# Altium project picphlipvfd.PrjPCB
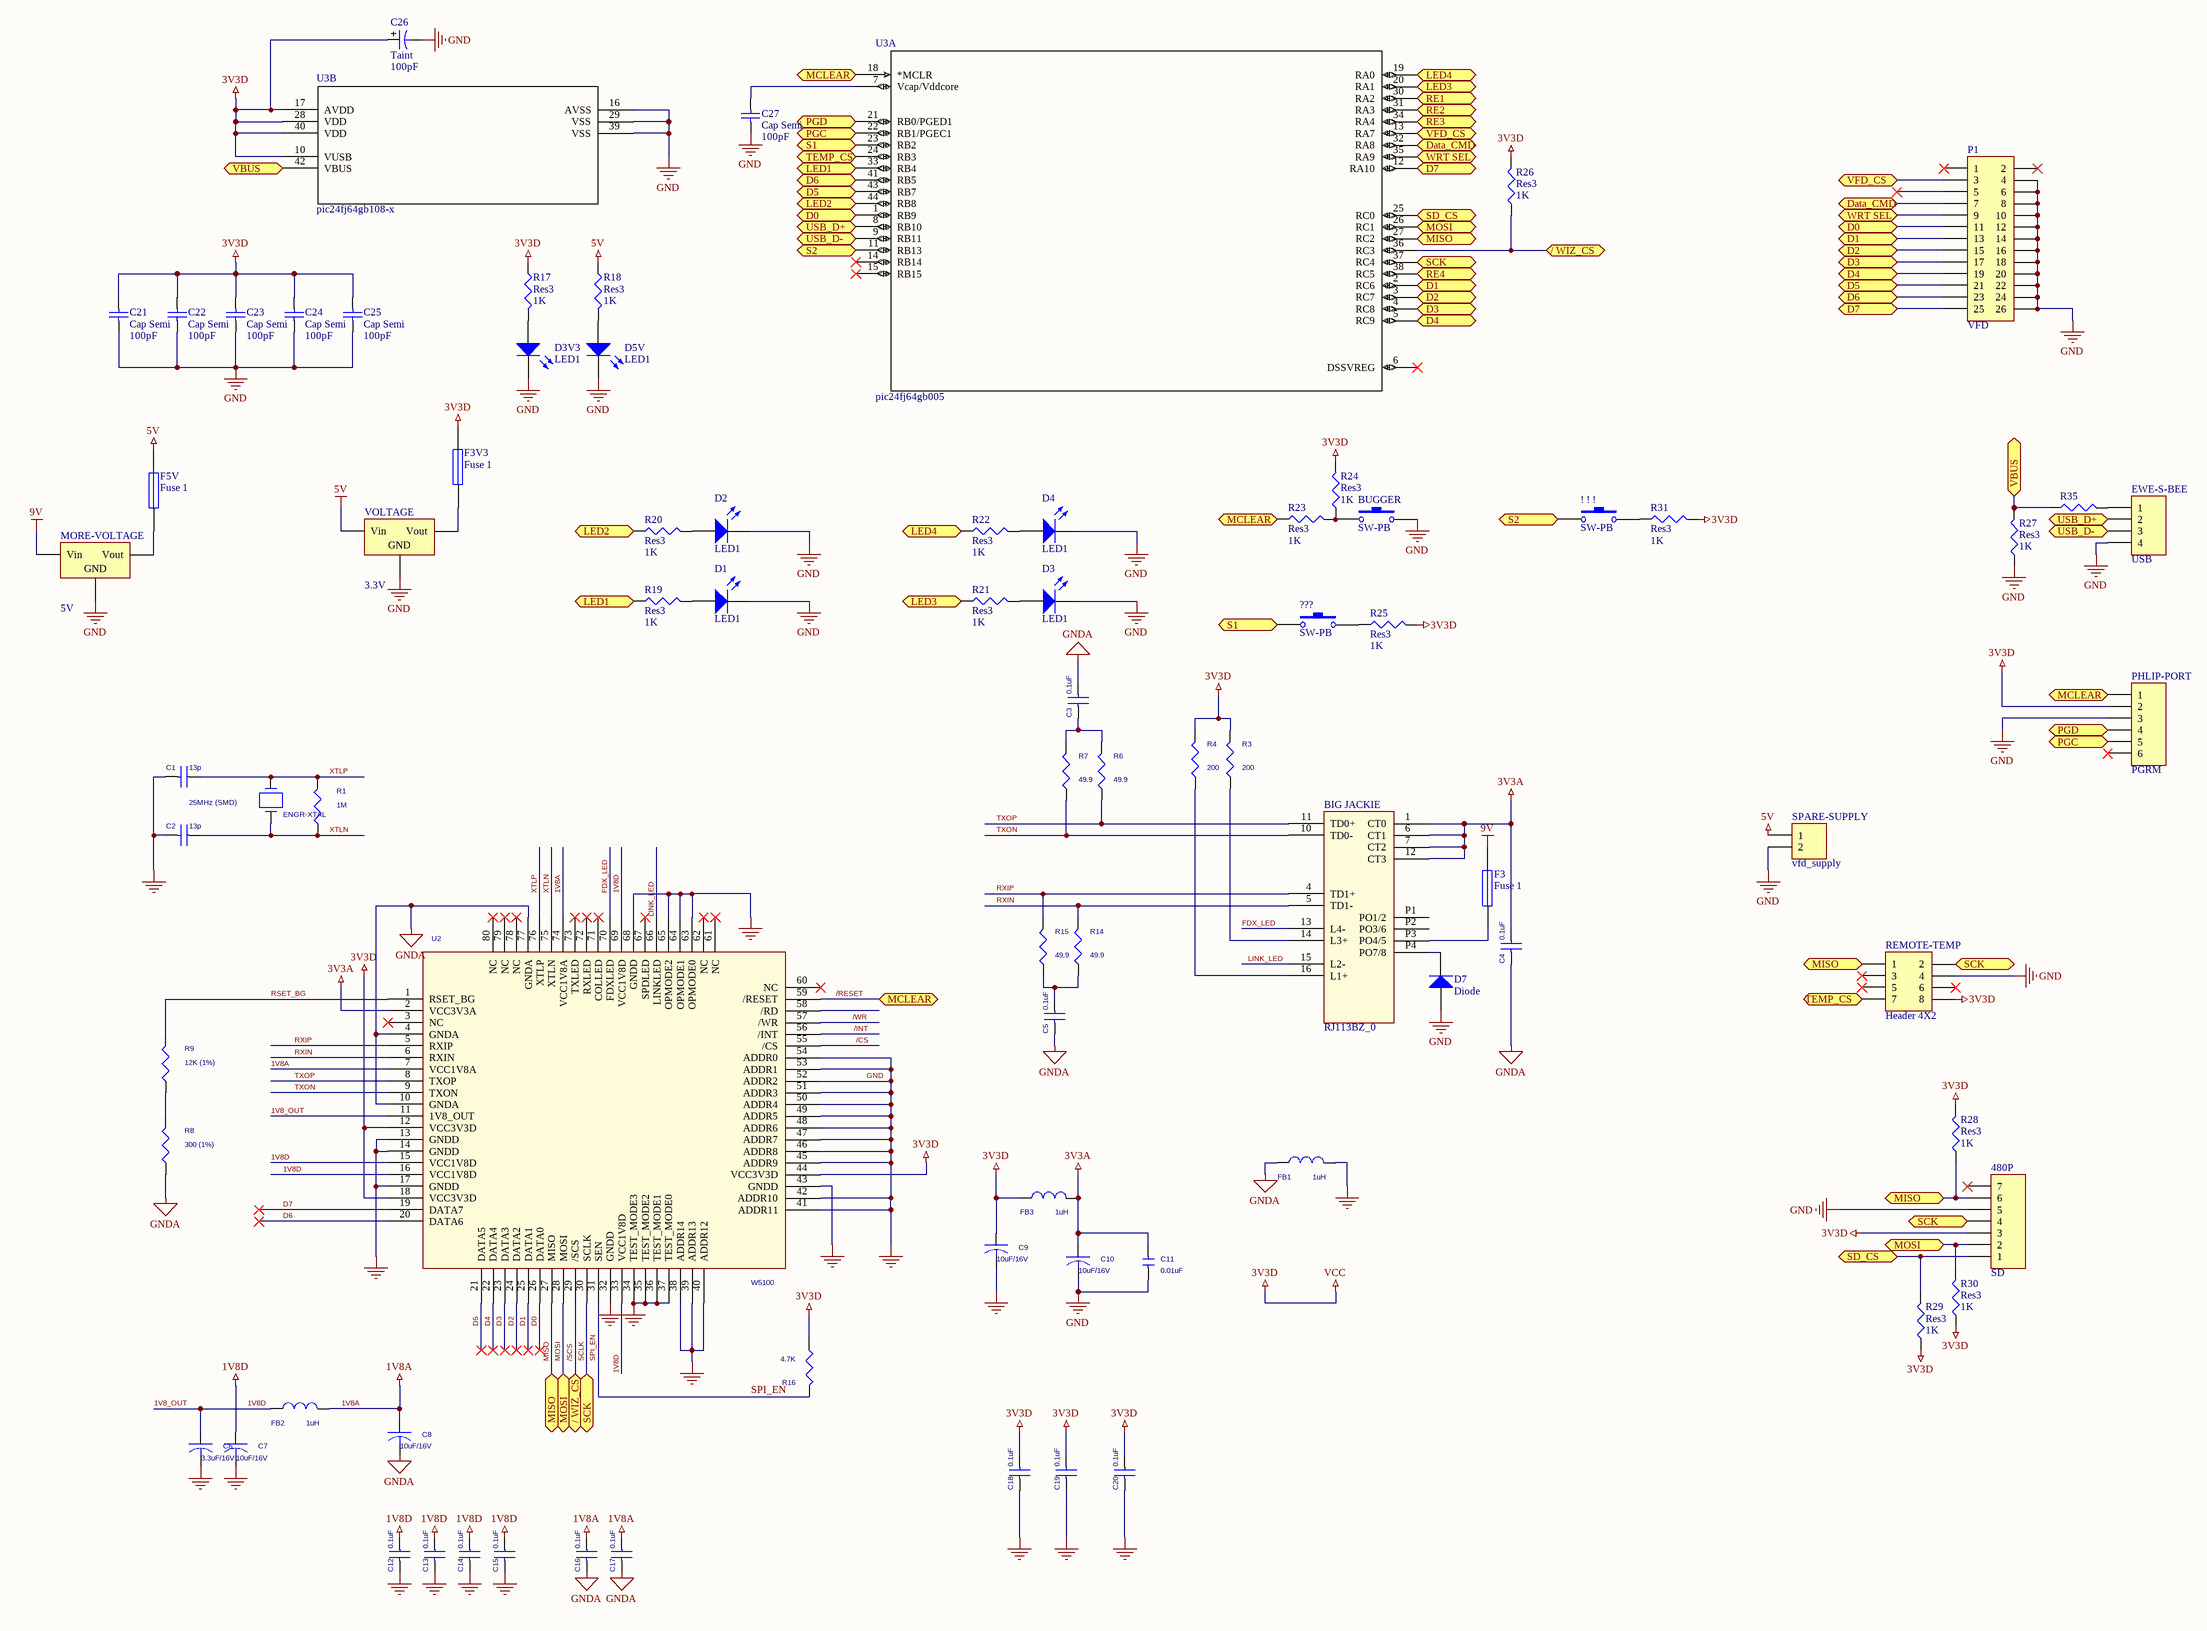
[diagram p0: picphlipvfd.SchDoc]
1 sheet, 81 parts. Net scope: flat (ports and power ports of the same name join across sheets).
Board file: picphlipvfd.PcbDoc

## Sheet picphlipvfd.SchDoc
size C; PageSetup: Record=PageOptions|CenterHorizontal=True|CenterVertical=True|PrintScale=2.17|XCorrection=1.00|YCorrection=1.00|PrintKind=1|BorderSize=5000000|LeftOffset=0|BottomOffset=0|Orientation=2|PaperLength=1000|PaperWidth=1000|Scale=100|PaperSource=7|PrintQuality=-4|MediaType=1|DitherType=10|PaperKind=A0|PrintScaleMode=1

### Parts
480P  SD  [MICRO-SD]
!_!_!  SW-PB  [Switch7914]
BIG_JACKIE  RJ113BZ_0  [POE]
BUGGER  SW-PB  [SWITCH-TACTILE-SPST-SMT-GULL-NO-KST241GLFS]
C1  13p  [CAP-0603]
C2  13p  [CAP-0603]
C3  0.1uF  [CAP-0603]
C4  0.1uF  [CAP-0603]
C5  0.1uF  [CAP-0603]
C6  3.3uF/16V  [CAP-0805]
C7  10uF/16V  [CAP-0805]
C8  10uF/16V  [CAP-0805]
C9  10uF/16V  [CAP-0805]
C10  10uF/16V  [CAP-0805]
C11  0.01uF  [CAP-0603]
C12  0.1uF  [CAP-0603]
C13  0.1uF  [CAP-0603]
C14  0.1uF  [CAP-0603]
C15  0.1uF  [CAP-0603]
C16  0.1uF  [CAP-0603]
C17  0.1uF  [CAP-0603]
C18  0.1uF  [CAP-0603]
C19  0.1uF  [CAP-0603]
C20  0.1uF  [CAP-0603]
C21  Cap Semi  value 100pF  [1608[0603]]
C22  Cap Semi  value 100pF  [1608[0603]]
C23  Cap Semi  value 100pF  [1608[0603]]
C24  Cap Semi  value 100pF  [1608[0603]]
C25  Cap Semi  value 100pF  [1608[0603]]
C26  Taint  value 100pF  [CAP-0805]
C27  Cap Semi  value 100pF  [1608[0603]]
D1  LED1  [LED-SMT-0603]
D2  LED1  [LED-SMT-0603]
D3  LED1  [LED-SMT-0603]
D3V3  LED1  [LED-SMT-0603]
D4  LED1  [LED-SMT-0603]
D5V  LED1  [LED-SMT-0603]
D7  Diode  [CAP-0805]
ENGR-XTAL  25MHz (SMD)  [XTAL-20MHZ-ATS200-SM]
EWE-S-BEE  USB  [CONN-USB-MICROB-SMT]
F3  Fuse 1  [INDUCTOR-0805]
F3V3  Fuse 1  [CAP-0805]
F5V  Fuse 1  [CAP-0805]
FB1  1uH  [INDUCTOR-0805]
FB2  1uH  [INDUCTOR-0805]
FB3  1uH  [INDUCTOR-0805]
MORE-VOLTAGE  5V  [TO-220]
P1  VFD  [HDR13F]
PHLIP-PORT  PGRM  [CONN-HEADER-HOR-SMT-1x6]
R1  1M  [RES-0603]
R3  200  [RES-0603]
R4  200  [RES-0603]
R6  49.9  [RES-0603]
R7  49.9  [RES-0603]
R8  300 (1%)  [CAP-0603]
R9  12K (1%)  [RES-0603]
R14  49.9  [RES-0603]
R15  49.9  [RES-0603]
R16  4.7K  [RES-0603]
R17  Res3  value 1K  [J1-0603]
R18  Res3  value 1K  [J1-0603]
R19  Res3  value 1K  [J1-0603]
R20  Res3  value 1K  [J1-0603]
R21  Res3  value 1K  [J1-0603]
R22  Res3  value 1K  [J1-0603]
R23  Res3  value 1K  [J1-0603]
R24  Res3  value 1K  [J1-0603]
R25  Res3  value 1K  [J1-0603]
R26  Res3  value 1K  [J1-0603]
R27  Res3  value 1K  [J1-0603]
R28  Res3  value 1K  [J1-0603]
R29  Res3  value 1K  [J1-0603]
R30  Res3  value 1K  [J1-0603]
R31  Res3  value 1K  [J1-0603]
R35  Res3  value 1K  [J1-0603]
REMOTE-TEMP  Header 4X2  [HDR2X4]
S1  SW-PB  [Switch7914]
SPARE-SUPPLY  vfd_supply  [PHO2pos2.54]
U2  W5100  [Quad80]
U3  pic24fj64gb005  [TQFP_44_M]  (parts A,B of 2)
VOLTAGE  3.3V  [TO-220]

### Ports
/ WIZ_CS, D0, D1, D2, D3, D4, D5, D6, D7, Data_CMD, LED1, LED2, LED3, LED4, MCLEAR, MISO, MOSI, PGC, PGD, RE1, RE2, RE3, RE4, S1, S2, SCK, SD_CS, TEMP_CS, USB_D+, USB_D-, VBUS, VFD_CS, WRT SEL

### Nets
1V8_OUT: C6.1 C7.1 C12.1 C13.1 C14.1 C15.1 FB2.1 U2.11(1V8_OUT) U2.15(VCC1V8D) U2.16(VCC1V8D) U2.33(VCC1V8D) U2.69(VCC1V8D)  [also labelled 1V8D]
1V8A: C8.1 C16.1 C17.1 FB2.2 U2.7(VCC1V8A) U2.74(VCC1V8A)
3V3A: BIG_JACKIE.1(CT0) BIG_JACKIE.6(CT1) BIG_JACKIE.7(CT2) BIG_JACKIE.12(CT3) C4.1 C10.1 C11.1 FB3.2 U2.2(VCC3V3A)
3V3D: 480P.3 C9.1 C18.1 C19.1 C20.1 C21.2 C22.2 C23.2 C24.2 C25.2 C26.1 F3V3.2 FB3.1 PHLIP-PORT.2 R3.2 R4.2 R16.1 R17.1 R24.2 R25.2 R26.2 R28.2 R29.1 R30.1 R31.2 REMOTE-TEMP.8 U2.12(VCC3V3D) U2.18(VCC3V3D) U2.44(VCC3V3D) U3.10(VUSB) U3.17(AVDD) U3.28(VDD) U3.40(VDD)  [also labelled VCC]
5V: F5V.2 R18.1 SPARE-SUPPLY.1 VOLTAGE.1(Vin)
9V: F3.2 MORE-VOLTAGE.1(Vin)
GND: 480P.5 BUGGER.2 C1.2 C2.2 C6.2 C7.2 C9.2 C10.2 C11.2 C12.2 C13.2 C14.2 C15.2 C18.2 C19.2 C20.2 C21.1 C22.1 C23.1 C24.1 C25.1 C26.2 C27.1 D1.2(K) D2.2(K) D3.2(K) D3V3.2(K) D4.2(K) D5V.2(K) D7.1(A) EWE-S-BEE.4 FB1.2 MORE-VOLTAGE.2(GND) P1.4 P1.6 P1.8 P1.10 P1.12 P1.14 P1.16 P1.18 P1.20 P1.22 P1.24 P1.26 PHLIP-PORT.3 R27.1 REMOTE-TEMP.4 SPARE-SUPPLY.2 U2.13(GNDD) U2.14(GNDD) U2.17(GNDD) U2.32(GNDD) U2.34(TEST_MODE3) U2.35(TEST_MODE2) U2.36(TEST_MODE1) U2.37(TEST_MODE0) U2.38(ADDR14) U2.39(ADDR13) U2.40(ADDR12) U2.41(ADDR11) U2.42(ADDR10) U2.43(GNDD) U2.45(ADDR9) U2.46(ADDR8) U2.47(ADDR7) U2.48(ADDR6) U2.49(ADDR5) U2.50(ADDR4) U2.51(ADDR3) U2.52(ADDR2) U2.53(ADDR1) U2.54(ADDR0) U2.63(OPMODE0) U2.64(OPMODE1) U2.65(OPMODE2) U2.68(GNDD) U3.16(AVSS) U3.29(VSS) U3.39(VSS) VOLTAGE.2(GND)
GNDA: C3.1 C4.2 C5.2 C8.2 C16.2 C17.2 FB1.1 R8.1 U2.4(GNDA) U2.10(GNDA) U2.77(GNDA)
/CS: U2.55(/CS)
/INT: U2.56(/INT)
/RESET: PHLIP-PORT.1 R23.1 U2.59(/RESET) U3.18(*MCLR) ; port MCLEAR
/SCS: R26.1 U2.29(/SCS) U3.36(RC3) ; port / WIZ_CS
/WR: U2.57(/WR)
D0: U2.26(DATA0)
D1: U2.25(DATA1)
D2: U2.24(DATA2)
D3: U2.23(DATA3)
D4: U2.22(DATA4)
D5: U2.21(DATA5)
D6: U2.20(DATA6)
D7: U2.19(DATA7)
FDX_LED: BIG_JACKIE.13(L4-) U2.70(FDXLED)
LINK_LED: BIG_JACKIE.15(L2-) U2.66(LINKLED)
MISO: 480P.6 R28.1 REMOTE-TEMP.1 U2.27(MISO) U3.27(RC2) ; port MISO
MOSI: 480P.2 R30.2 U2.28(MOSI) U3.26(RC1) ; port MOSI
RSET_BG: R9.2 U2.1(RSET_BG)
RXIN: BIG_JACKIE.5(TD1-) R14.2 U2.6(RXIN)
RXIP: BIG_JACKIE.4(TD1+) R15.2 U2.5(RXIP)
SCLK: 480P.4 REMOTE-TEMP.2 U2.30(SCLK) U3.37(RC4) ; port SCK
SPI_EN: R16.2 U2.31(SEN)
TXON: BIG_JACKIE.10(TD0-) R7.1 U2.9(TXON)
TXOP: BIG_JACKIE.11(TD0+) R6.1 U2.8(TXOP)
XTLN: C2.1 ENGR-XTAL.2 R1.1 U2.75(XTLN)
XTLP: C1.1 ENGR-XTAL.1 R1.2 U2.76(XTLP)
Net480P_1: 480P.1 R29.2 U3.25(RC0) ; port SD_CS
Net!_!_!_1: !_!_!.1 U3.11(RB13) ; port S2
Net!_!_!_2: !_!_!.2 R31.1
NetBIG_JACKIE_14: BIG_JACKIE.14(L3+) R3.1
NetBIG_JACKIE_16: BIG_JACKIE.16(L1+) R4.1
NetBIG_JACKIE_P3: BIG_JACKIE.P3(PO4/5) F3.1
NetBIG_JACKIE_P4: BIG_JACKIE.P4(PO7/8) D7.2(K)
NetBUGGER_1: BUGGER.1 R23.2 R24.1
NetC3_2: C3.2 R6.2 R7.2
NetC5_1: C5.1 R14.1 R15.1
NetC27_2: C27.2 U3.7(Vcap/Vddcore)
NetD1_1: D1.1(A) R19.2
NetD2_1: D2.1(A) R20.2
NetD3_1: D3.1(A) R21.2
NetD3V3_1: D3V3.1(A) R17.2
NetD4_1: D4.1(A) R22.2
NetD5V_1: D5V.1(A) R18.2
NetEWE-S-BEE_1: EWE-S-BEE.1 R35.2
NetEWE-S-BEE_2: EWE-S-BEE.2 U3.8(RB10) ; port USB_D+
NetEWE-S-BEE_3: EWE-S-BEE.3 U3.9(RB11) ; port USB_D-
NetF3V3_1: F3V3.1 VOLTAGE.3(Vout)
NetF5V_1: F5V.1 MORE-VOLTAGE.3(Vout)
NetP1_3: P1.3 U3.13(RA7) ; port VFD_CS
NetP1_7: P1.7 U3.32(RA8) ; port Data_CMD
NetP1_9: P1.9 U3.35(RA9) ; port WRT SEL
NetP1_11: P1.11 U3.1(RB9) ; port D0
NetP1_13: P1.13 U3.2(RC6) ; port D1
NetP1_15: P1.15 U3.3(RC7) ; port D2
NetP1_17: P1.17 U3.4(RC8) ; port D3
NetP1_19: P1.19 U3.5(RC9) ; port D4
NetP1_21: P1.21 U3.43(RB7) ; port D5
NetP1_23: P1.23 U3.41(RB5) ; port D6
NetP1_25: P1.25 U3.12(RA10) ; port D7
NetPHLIP-PORT_4: PHLIP-PORT.4 U3.21(RB0/PGED1) ; port PGD
NetPHLIP-PORT_5: PHLIP-PORT.5 U3.22(RB1/PGEC1) ; port PGC
NetR8_2: R8.2 R9.1
NetR19_1: R19.1 U3.33(RB4) ; port LED1
NetR20_1: R20.1 U3.44(RB8) ; port LED2
NetR21_1: R21.1 U3.20(RA1) ; port LED3
NetR22_1: R22.1 U3.19(RA0) ; port LED4
NetR25_1: R25.1 S1.2
NetR27_2: R27.2 R35.1 U3.42(VBUS) ; port VBUS
NetREMOTE-TEMP_7: REMOTE-TEMP.7 U3.24(RB3) ; port TEMP_CS
NetS1_1: S1.1 U3.23(RB2) ; port S1
NetU3_30: U3.30(RA2) ; port RE1
NetU3_31: U3.31(RA3) ; port RE2
NetU3_34: U3.34(RA4) ; port RE3
NetU3_38: U3.38(RC5) ; port RE4

Not connected (* = marked no-connect by the designer): 480P 7*; BIG_JACKIE P1(PO1/2) P2(PO3/6); P1 1* 2* 5*; PHLIP-PORT 6*; REMOTE-TEMP 3* 5* 6*; U2 3(NC)* 58(/RD) 60(NC)* 61(NC)* 62(NC)* 67(SPDLED)* 71(COLLED)* 72(RXLED)* 73(TXLED)* 78(NC)* 79(NC)* 80(NC)*; U3 6(DSSVREG)* 14(RB14)* 15(RB15)*

### Library data of the parts
480P = MHDR1X7: Header, 7-Pin; LatestRevisionDate: 17-Jul-2002; LatestRevisionNote: Re-released for DXP Platform.; Publisher: Altium Limited
!_!_! BUGGER S1 = SW-PB: Switch; Published: 24-Mar-1999; LatestRevisionDate: 17-Jul-2002; LatestRevisionNote: Re-released for DXP Platform.; PackageReference: SPST-2; Publisher: Altium Limited; PackageDescription: Switch; 2 Leads
C1-C5 C12-C20 = CAP NP
C6-C10 = CAP_4.7uF_B
C11 = CAP_0.01uF_0603
C21-C25 C27 = Cap Semi: Capacitor (Semiconductor SIM Model); Published: 8-Jun-2000; LatestRevisionDate: 29-May-2009; LatestRevisionNote: IPC-7351 Footprint Added.; PackageReference: C1206; Publisher: Altium Limited; PackageDescription: Chip Capacitor
C26 = Cap Pol3: Polarized Capacitor (Surface Mount); Published: 8-Jun-2000; LatestRevisionDate: 29-May-2009; LatestRevisionNote: IPC-7351 Footprint Added.; PackageReference: C0805; Publisher: Altium Limited; PackageDescription: Chip Capacitor
D1-D3 D3V3 D4 D5V = LED1: Typical RED GaAs LED; Published: 8-Jun-2000; LatestRevisionDate: 08-Jul-2005; LatestRevisionNote: Mech Layer 1 removed.; PackageReference: LED-1; Publisher: Altium Limited; PackageDescription: LED; 2 Leads
D7 = Diode: Default Diode; Published: 8-Jun-2000; LatestRevisionDate: 17-Jul-2002; LatestRevisionNote: Re-released for DXP Platform.; PackageVersion: Sep-1996; PackageReference: SMC; Publisher: Altium Limited; PackageDescription: DO-214-AB/SMC; 2 C-Bend Leads; Body 7.9 x 5.9 mm, inc. leads (LxW); Code_JEDEC: DO-214-AB
ENGR-XTAL = CRYSTAL
EWE-S-BEE = MHDR1X4: Header, 4-Pin; LatestRevisionDate: 17-Jul-2002; LatestRevisionNote: Re-released for DXP Platform.; Publisher: Altium Limited
F3 F3V3 F5V = Fuse 1: Fuse; Published: 8-Jun-2000; LatestRevisionDate: 17-Jul-2002; LatestRevisionNote: Re-released for DXP Platform.; PackageReference: PIN-W2/E2.8; Publisher: Altium Limited; PackageDescription: Thru-Hole; 2 Leads
FB1-FB3 = FB_0805
MORE-VOLTAGE VOLTAGE = Volt Reg: Voltage Regulator; Published: 24-Mar-1999; LatestRevisionDate: 29-May-2009; LatestRevisionNote: IPC-7351 Footprint Added.; PackageReference: D2PAK; Publisher: Altium Limited; PackageDescription: 3-Pin Transistor Outline Package 2.54 mm Pitch, 15.1 mm Lead Span
P1 = Header 13X2: Header, 13-Pin, Dual row; LatestRevisionDate: 17-Jul-2002; LatestRevisionNote: Re-released for DXP Platform.; Publisher: Altium Limited
PHLIP-PORT = MHDR1X6: Header, 6-Pin; LatestRevisionDate: 17-Jul-2002; LatestRevisionNote: Re-released for DXP Platform.; Publisher: Altium Limited
R1 R8 R9 = R_Dup1
R3 R4 R6 R7 R14-R16 = R
R17-R31 R35 = Res3: Resistor; Published: 8-Jun-2000; LatestRevisionDate: 29-May-2009; LatestRevisionNote: IPC-7351 Footprint Added.; PackageReference: J1-0603; Publisher: Altium Limited; PackageDescription: Chip Resistor
REMOTE-TEMP = Header 4X2: Header, 4-Pin, Dual row; LatestRevisionDate: 17-Jul-2002; LatestRevisionNote: Re-released for DXP Platform.; Publisher: Altium Limited
SPARE-SUPPLY = Header 2: Header, 2-Pin; LatestRevisionDate: 17-Jul-2002; LatestRevisionNote: Re-released for DXP Platform.; Publisher: Altium Limited
U2 = W5100_7
U3 = pic24fj64gb108-x: Imported; RefDes: RefDes; Type: Type; Value: Value